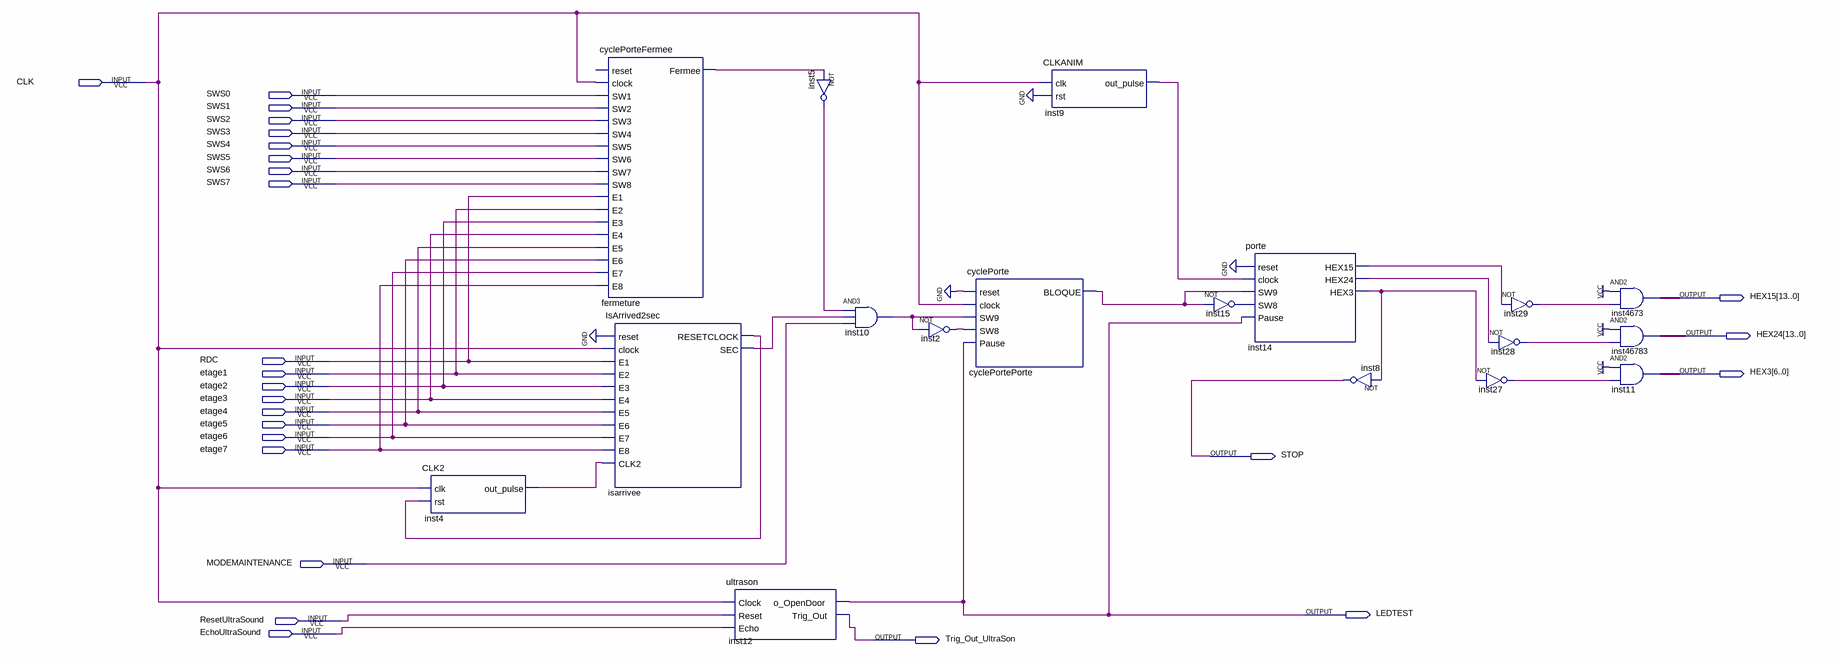
[diagram p0: schematic sheet]
// Quartus schematic animation_porte.bdf as structural Verilog: 18 symbols, 26 pins
module animation_porte (
  input  CLK,
  input  SWS0,
  input  SWS1,
  input  SWS2,
  input  SWS3,
  input  SWS4,
  input  SWS5,
  input  SWS6,
  input  SWS7,
  input  RDC,
  input  etage1,
  input  etage2,
  input  etage3,
  input  etage4,
  input  etage5,
  input  etage6,
  input  etage7,
  input  MODEMAINTENANCE,
  input  ResetUltraSound,
  input  EchoUltraSound,
  output [13:0] HEX15,
  output [13:0] HEX24,
  output [6:0] HEX3,
  output STOP,
  output LEDTEST,
  output Trig_Out_UltraSon
);

  wire cyclePortePorte_bloque, fermeture_fermee, inst2_out, inst4_out_pulse, inst5_out, inst9_out_pulse,
       inst10_out, inst14_hex3, inst14_hex15, inst14_hex24, inst15_out, inst27_out, inst28_out, inst29_out,
       isarrivee_resetclock, isarrivee_sec;

  CLK2 inst4 (.clk(CLK), .rst(isarrivee_resetclock), .out_pulse(inst4_out_pulse));
  cyclePorteFermee fermeture (
    .clock(CLK), .SW1(SWS0), .SW2(SWS1), .SW3(SWS2), .SW4(SWS3), .SW5(SWS4), .SW6(SWS5), .SW7(SWS6),
    .SW8(SWS7), .E1(RDC), .E2(etage1), .E3(etage2), .E4(etage3), .E5(etage4), .E6(etage5), .E7(etage6),
    .E8(etage7), .Fermee(fermeture_fermee));  // open: reset
  IsArrived2sec isarrivee (
    .reset(1'b0), .clock(CLK), .E1(RDC), .E2(etage1), .E3(etage2), .E4(etage3), .E5(etage4), .E6(etage5),
    .E7(etage6), .E8(etage7), .CLK2(inst4_out_pulse), .RESETCLOCK(isarrivee_resetclock), .SEC(isarrivee_sec));
  ultrason inst12 (
    .Clock(CLK), .Reset(ResetUltraSound), .Echo(EchoUltraSound), .o_OpenDoor(LEDTEST),
    .Trig_Out(Trig_Out_UltraSon));
  not inst5 (inst5_out, fermeture_fermee);
  and inst10 (inst10_out, inst5_out, isarrivee_sec, MODEMAINTENANCE);
  cyclePorte cyclePortePorte (
    .reset(1'b0), .clock(CLK), .SW9(inst10_out), .SW8(inst2_out), .Pause(LEDTEST),
    .BLOQUE(cyclePortePorte_bloque));
  not inst2 (inst2_out, inst10_out);
  CLKANIM inst9 (.clk(CLK), .rst(1'b0), .out_pulse(inst9_out_pulse));
  not inst15 (inst15_out, cyclePortePorte_bloque);
  porte inst14 (
    .reset(1'b0), .clock(inst9_out_pulse), .SW9(cyclePortePorte_bloque), .SW8(inst15_out), .Pause(LEDTEST),
    .HEX15(inst14_hex15), .HEX24(inst14_hex24), .HEX3(inst14_hex3));
  not inst8 (STOP, inst14_hex3);
  not inst29 (inst29_out, inst14_hex15);
  not inst28 (inst28_out, inst14_hex24);
  not inst27 (inst27_out, inst14_hex3);
  assign HEX15 = {14{1'b1}} & {14{inst29_out}};  // AND2 inst4673, 14 bits wide
  assign HEX24 = {14{1'b1}} & {14{inst28_out}};  // AND2 inst46783, 14 bits wide
  assign HEX3 = {7{1'b1}} & {7{inst27_out}};  // AND2 inst11, 7 bits wide
endmodule
